# EAGLE design antenna (EAGLE 6.6.0)
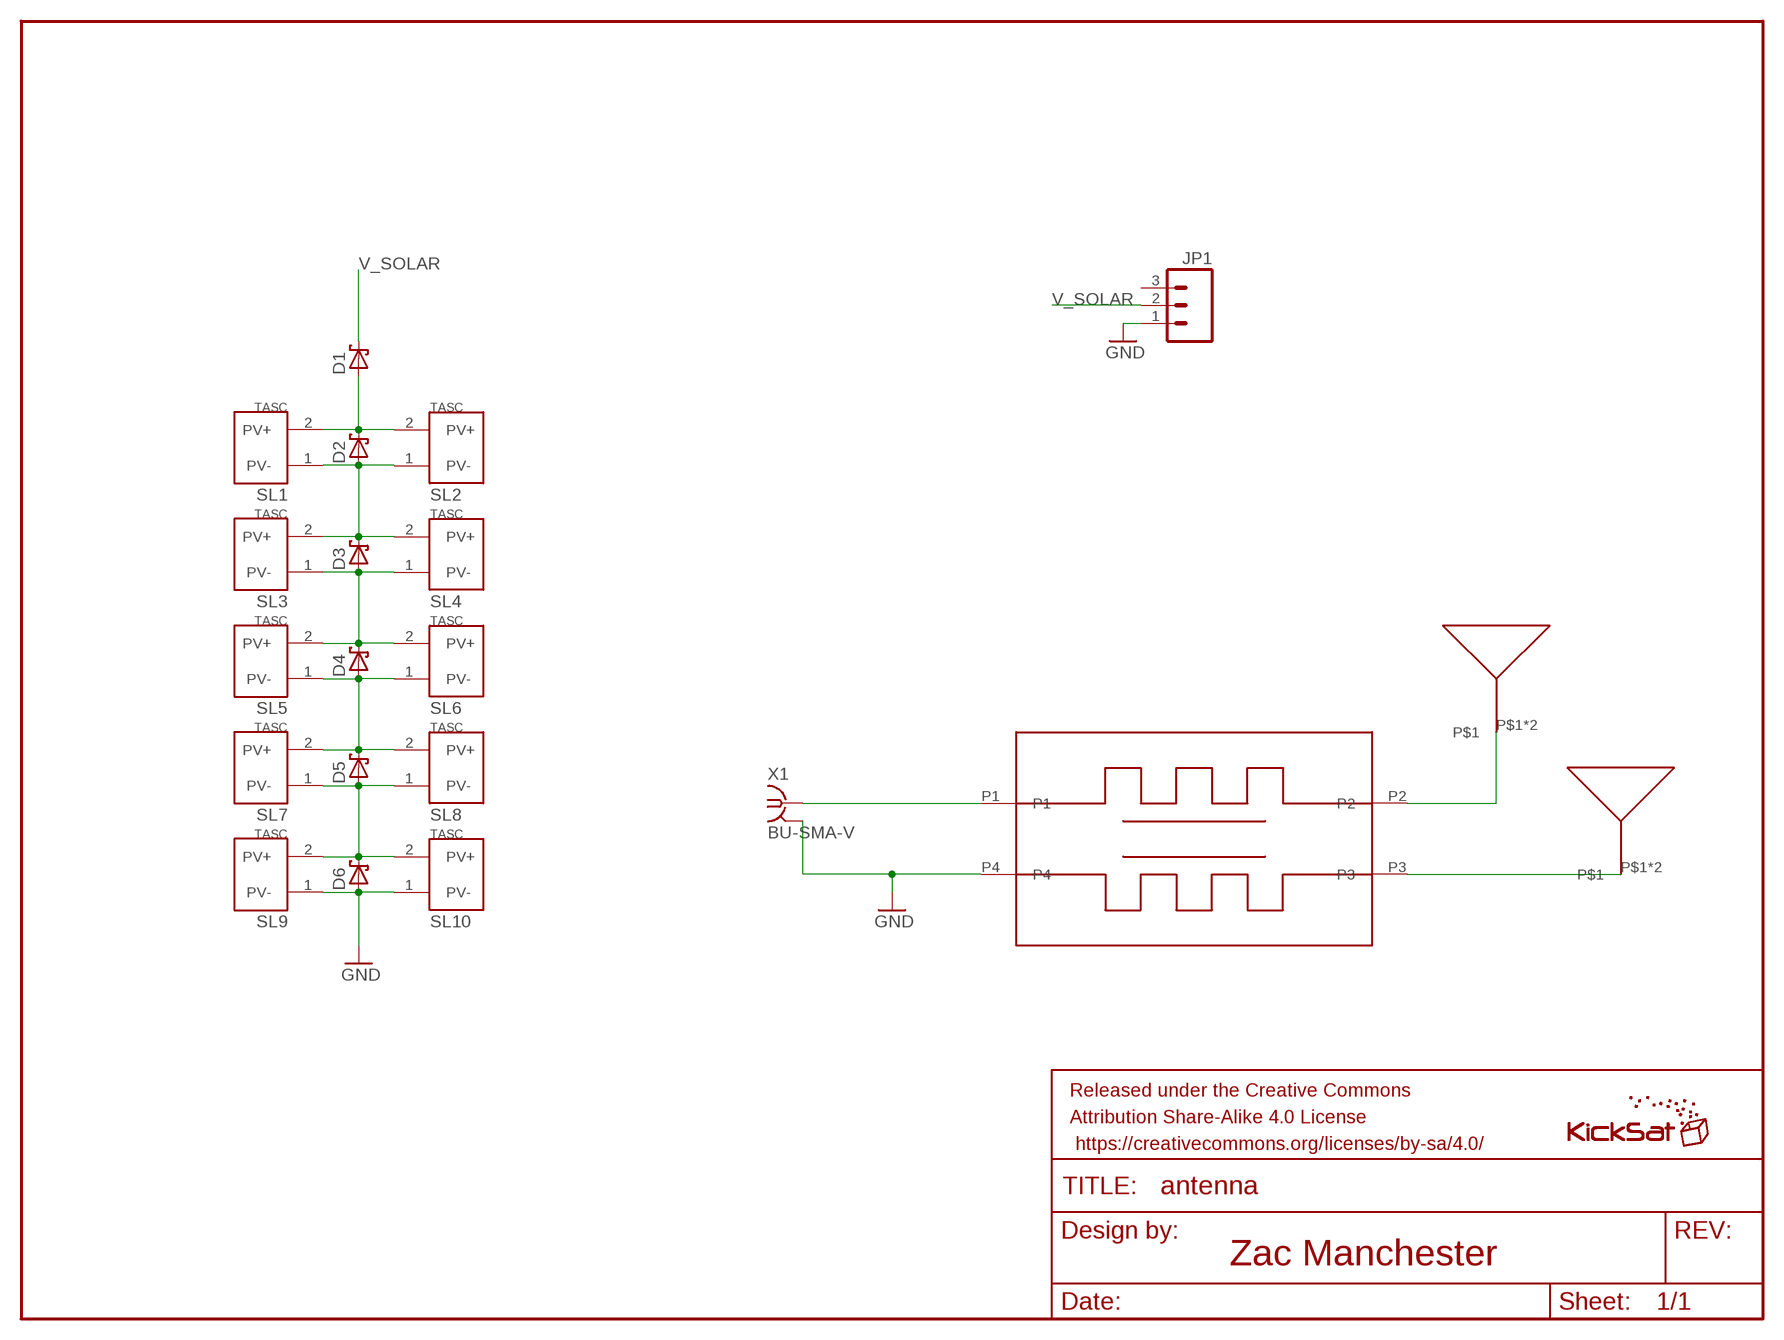
[diagram p0: schematic, sheet 1]

## Parts
B1  BALUN  [BALUN]
D1  SB_DIODE  [SB_DIODE]
D2  SB_DIODE  [SB_DIODE]
D3  SB_DIODE  [SB_DIODE]
D4  SB_DIODE  [SB_DIODE]
D5  SB_DIODE  [SB_DIODE]
D6  SB_DIODE  [SB_DIODE]
FRAME1  FRAME-LETTER  [CREATIVE_COMMONS]
JP1  M03POLAR_LOCK  [MOLEX-1X3_LOCK]
SL1  SOLAR_CELL  [SOLAR_CELL]
SL2  SOLAR_CELL  [SOLAR_CELL]
SL3  SOLAR_CELL  [SOLAR_CELL]
SL4  SOLAR_CELL  [SOLAR_CELL]
SL5  SOLAR_CELL  [SOLAR_CELL]
SL6  SOLAR_CELL  [SOLAR_CELL]
SL7  SOLAR_CELL  [SOLAR_CELL]
SL8  SOLAR_CELL  [SOLAR_CELL]
SL9  SOLAR_CELL  [SOLAR_CELL]
SL10  SOLAR_CELL  [SOLAR_CELL]
U$1  TAPEANTENNA  [TAPEANTENNA]
U$2  TAPEANTENNA  [TAPEANTENNA]
U$3  KICKSAT_LOGO  [KICKSAT_LOGO]
X1  BU-SMA-V  [BU-SMA-V]

## Nets
GND: B1.P4 D6.POS JP1.1 SL9.1(PV-) SL10.1(PV-) X1.2 X1.3 X1.4 X1.5
N$1: B1.P1 X1.1
N$9: D1.POS D2.NEG SL1.2(PV+) SL2.2(PV+)
N$37: D3.POS D4.NEG SL3.1(PV-) SL4.1(PV-) SL5.2(PV+) SL6.2(PV+)
N$39: D4.POS D5.NEG SL5.1(PV-) SL6.1(PV-) SL7.2(PV+) SL8.2(PV+)
N$45: D2.POS D3.NEG SL1.1(PV-) SL2.1(PV-) SL3.2(PV+) SL4.2(PV+)
N$50: D5.POS D6.NEG SL7.1(PV-) SL8.1(PV-) SL9.2(PV+) SL10.2(PV+)
RFN: B1.P2 U$1.P$1 U$1.P$2
RFP: B1.P3 U$2.P$1 U$2.P$2
V_SOLAR: D1.NEG JP1.2
Unconnected: JP1.3

## Notes on the sheet
- Zac Manchester

## Library data of the parts
B1 = Balun:BALUN
D1-D6 = phonesat:SB_DIODE
FRAME1 = SparkFun-Aesthetics:FRAME-LETTER: Schematic Frame Standard 8.5x11 US Letter frame
JP1 = SparkFun-Connectors:M03: Header 3 Standard 3-pin 0.1" header. Use with straight break away headers (SKU : PRT-00116), right angle break away headers (PRT-00553), swiss pins (PRT-00743), machine pins (PRT-00117), and female headers (PRT-00115). Molex polarized connector foot print use with SKU : PRT-08232 with associated crimp pins and housings.
SL1-SL10 = phonesat:SOLAR_CELL
U$1 U$2 = TapeAntenna:TAPEANTENNA
U$3 = KickSat-Logo:KICKSAT_LOGO
X1 = con-coax:BU-SMA-V: FEMALE SMA CONNECTOR Radiall distributor RS 112-3794; OC_FARNELL: unknown; OC_NEWARK: unknown

## Board
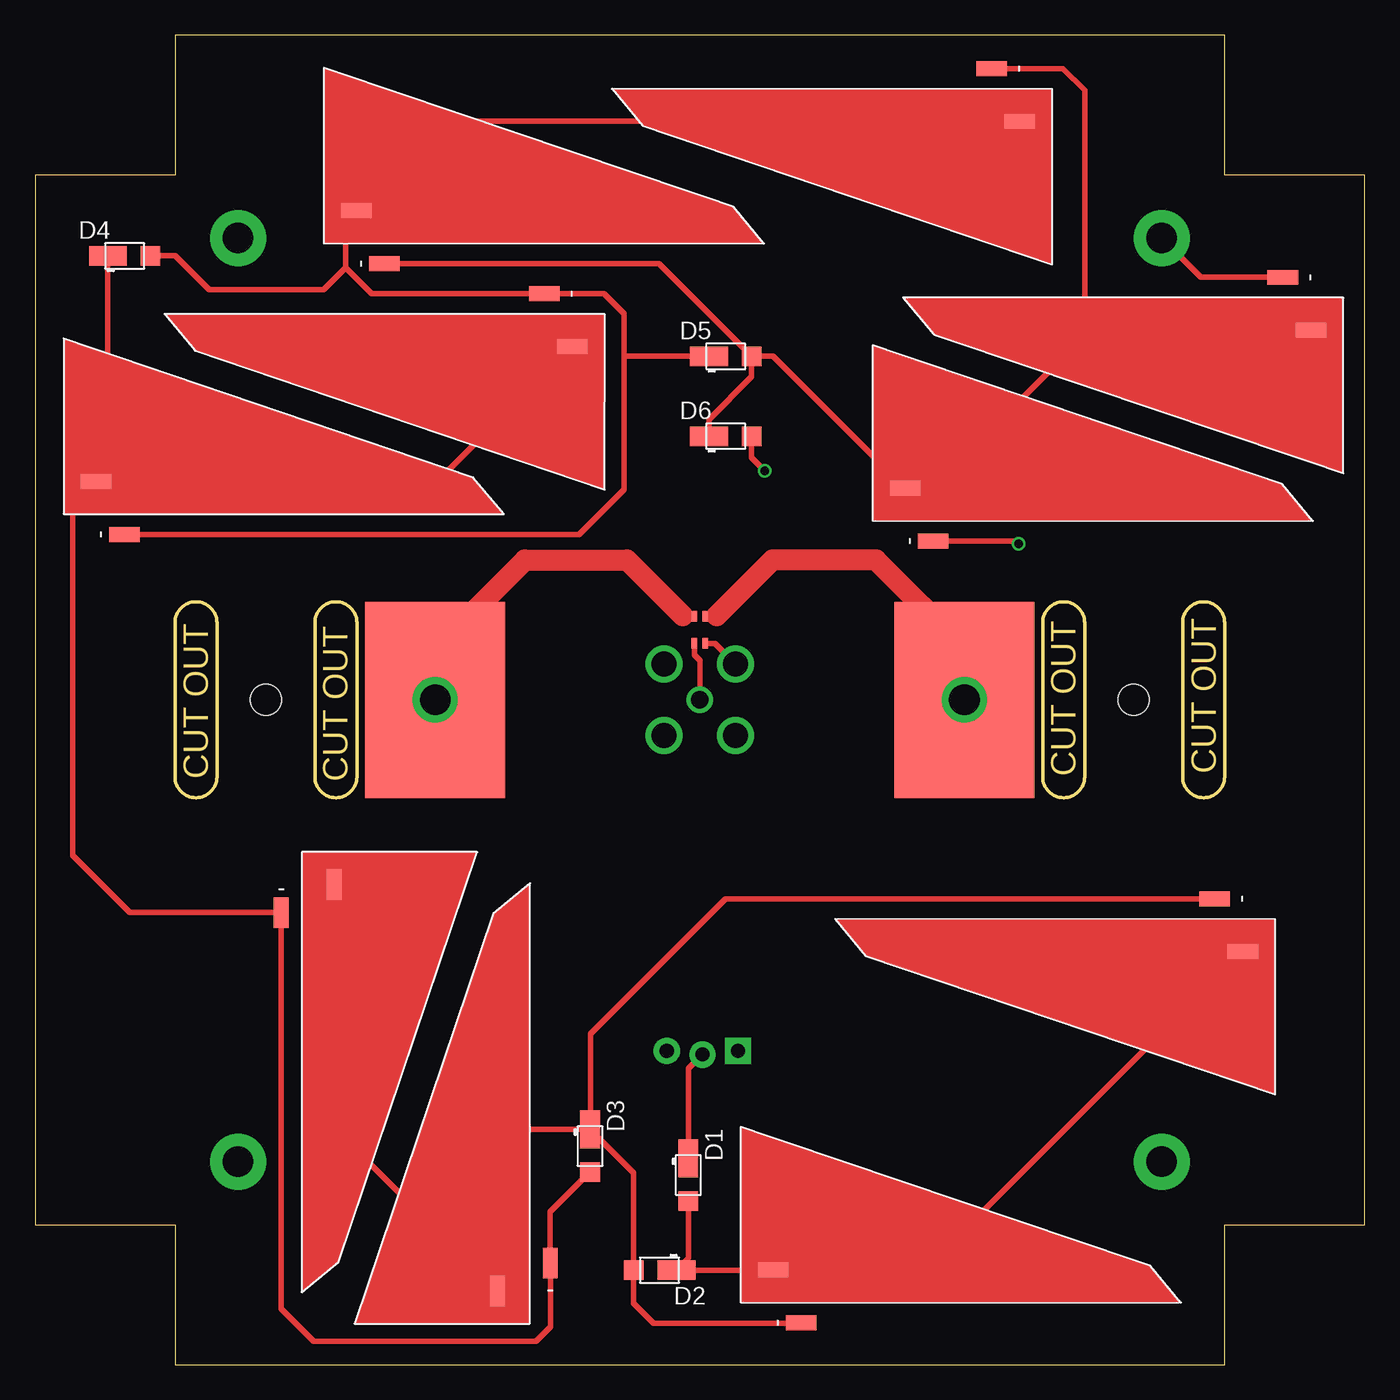
[diagram p1: board, top side]
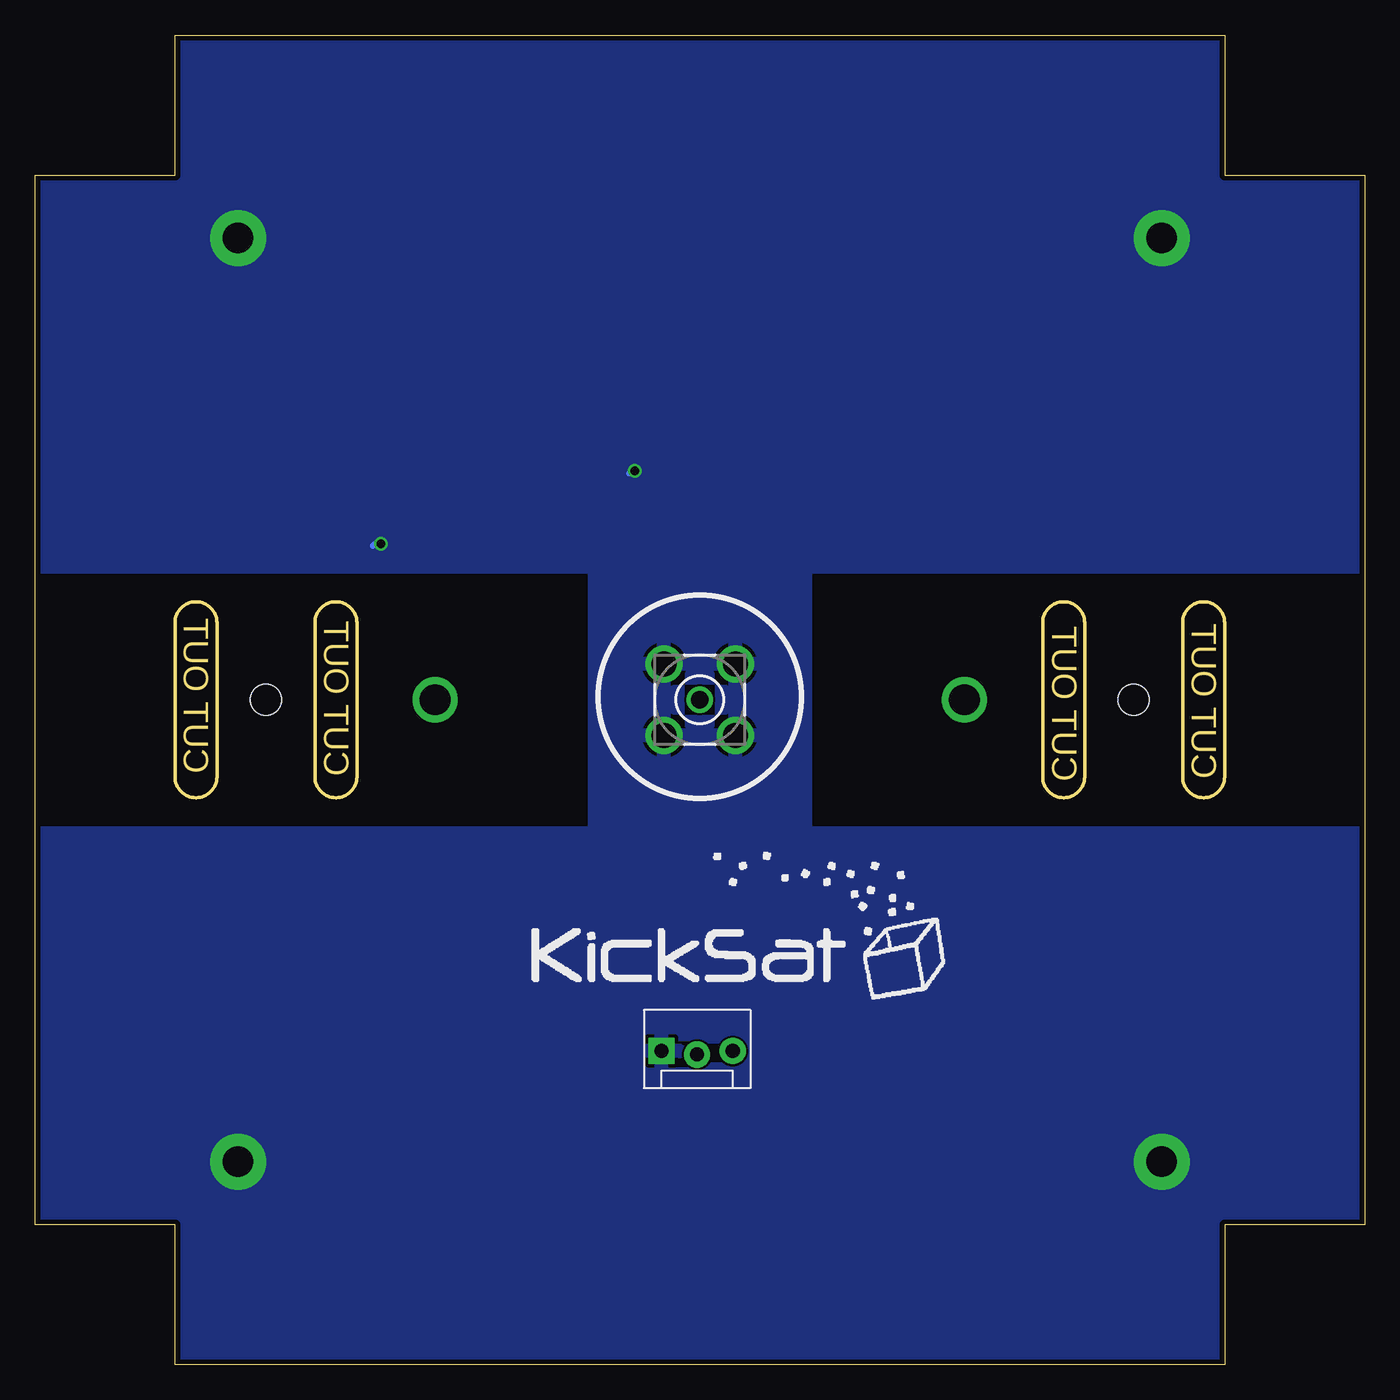
[diagram p2: board, bottom side, seen from below]

Size 95 x 95 mm. Coordinates in mm from the lower left corner, seen from the top.
Outline: 0,10 10,10 10,0 85,0 85,10 95,10 95,85 85,85 85,95 10,95 10,85 0,85 0,10
Outline: 75,53 75,42 arc-180 72,42 72,53 arc-180 75,53
Outline: 10,42 10,53 arc-180 13,53 13,42 arc-180 10,42
Outline: 20,42 20,53 arc-180 23,53 23,42 arc-180 20,42
Outline: 85,53 85,42 arc-180 82,42 82,53 arc-180 85,53
Copper layers (1*16): Top 0.0356mm / dielectric 1.5011mm / Bottom 0.0356mm
Design rules "OSHPark-2layer": minimum track width 6mil, minimum drill 13mil, track to track 6mil, track to pad 6mil, pad to pad 6mil, via to via 6mil, smd to smd 6mil, copper to edge 15mil, drill to drill 6mil, minimum pad ring 7mil, minimum via ring 7mil, stop-mask expansion 4mil, vias tented up to drill 0mil, thermal gap 10mil
Holes 2.2 mm at 16.5,47.5 78.5,47.5

### Footprints (pad centres in the part's own frame; a part is rotated, then mirrored left to right if it is on the bottom)
BALUN = smd 0.75 x 0.4: P1 -0.975,0.4; P2 0.975,0.4; P3 0.975,-0.4; P4 -0.975,-0.4
SB_DIODE = smd 2.7 x 1.4: NEG -1.2,0 | smd 1.4 x 1.4: POS 1.85,0
MOLEX-1X3_LOCK = drill 1.016 pad 1.88 square: 1 0,0.127 | drill 1.016 pad 1.88: 2 2.54,-0.127; 3 5.08,0.127
SOLAR_CELL = smd 1.067 x 2.184: 1 -1.589,2.999; 2 2.187,5.011
TAPEANTENNA = smd 10 x 14: P$1 0,0 | drill 2.2: P$2 0,0
BU-SMA-V = drill 1.27: 1 0,0 | drill 1.778: 2 -2.55,2.55; 3 2.55,2.55; 4 2.55,-2.55; 5 -2.55,-2.55

### Placement (x,y rotation side)
B1  47.5,52.5 90 top
D1  46.68,13.53 270 top
D2  44.63,6.74 180 top
D3  39.66,15.61 270 top
D4  6.41,79.22 0 top
D5  49.36,72.04 0 top
D6  49.36,66.33 0 top
FRAME1  20.71,-7.66 0 top  (outside the outline)
JP1  50.23,22.28 0 bottom
SL1  57.75,4.57 90 top
SL2  81.29,31.69 270 top
SL3  35.23,10.25 180 top
SL4  19.19,29.29 0 top
SL5  33.38,74.92 270 top
SL6  9.38,60.9 90 top
SL7  65.35,91.01 270 top
SL8  27.97,80.25 90 top
SL9  86.16,76.09 270 top
SL10  67.18,60.43 90 top
U$1  28.6,47.5 0 top
U$2  66.4,47.5 0 top
U$3  59.98,25.85 0 bottom
X1  47.5,47.5 0 bottom

### Tracks (layer width: path | path; a pad name or v marks a point on that pad's centre or on a via)
GND  (via drill 0.6, 2.2 pad 4)
  Top 0.4: B1.P4 48.58,51.52 X1.2
  Top 0.406: SL9.1 83.32,77.68 v80.5,80.5 | SL10.1 70.07,58.84 v70.28,58.63 | D6.POS 51.21,64.79 v52.13,63.87
  Bottom 0.406: v70.28,58.63 70.75,58.63 70.88,58.5 | v52.13,63.87 52.35,63.87 52.56,63.66
  other vias: 14.5,80.5 14.5,14.5 80.5,14.5
  pour Bottom: 0,57 40,57 40,38 0,38 0,10 10,10 10,0 85,0 85,10 95,10 95,38 55,38 55,57 95,57 95,85 85,85 85,95 10,95 10,85 0,85
N$1
  Top 0.4: X1.1 47.5,50.32 47.11,50.71 B1.P1
N$9
  Top 0.406: SL1.2 65.99,7.76 65.99,9.19 SL2.2 | 54.77,6.78 SL1.2 | SL1.2 52.72,6.74 D2.NEG 46.7,7.61 D1.POS
N$37
  Top 0.406: D3.POS 36.82,10.92 SL3.1 36.83,2.71 35.79,1.67 19.9,1.67 17.6,3.97 SL4.1 6.76,32.29 2.69,36.36 2.69,61.41 SL6.2 | SL6.2 28.75,63.09 SL5.2 | SL6.2 5.21,63.09 D4.NEG
N$39
  Top 0.406: SL6.1 38.89,59.31 42.1,62.52 42.1,71.93 | 42.1,71.93 42.1,75.08 40.66,76.52 SL5.1 24.06,76.51 22.21,78.36 | 22.21,78.36 22.21,82.37 22.14,82.44 SL8.2 29.34,88.82 SL7.2 | D5.NEG 42.21,72.04 42.1,71.93 | D4.POS 10.02,79.22 12.45,76.79 20.64,76.79 22.21,78.36
N$45
  Top 0.406: SL4.2 21.38,16.9 27.11,11.17 | 27.11,11.17 SL3.2 | 39.1,16.81 D3.NEG 42.78,13.69 D2.POS 42.78,4.39 44.21,2.96 54.73,2.96 SL1.1 | 39.1,16.81 32.75,16.81 27.11,11.17 | SL2.1 49.35,33.28 39.68,23.61 39.68,17.39 39.1,16.81
N$50
  Top 0.406: SL8.1 44.59,78.66 D5.POS | SL7.1 73.45,92.6 75,91.05 75,74.11 74.77,73.88 75.37,73.88 | 75.37,73.88 91.15,73.88 SL9.2 | 75.37,73.88 64.11,62.62 SL10.2 52.75,72.04 D5.POS | D6.NEG 48.16,67.53 51.21,70.58 D5.POS
RFN
  Top 0.4: B1.P2 46.33,53.48 46.3,53.5
  Top 1.5: 46.3,53.5 42.3,57.5 35,57.5 28.5,51 U$1.P$2
RFP
  Top 0.4: B1.P3 48.67,53.48 48.7,53.5
  Top 1.5: 48.7,53.5 52.7,57.5 60.1,57.5 66.5,51.1 U$2.P$2
V_SOLAR
  Top 0.406: D1.NEG 46.7,21.16 JP1.2

### Text on the board
Dimension: CUT OUT | CUT OUT | CUT OUT | CUT OUT